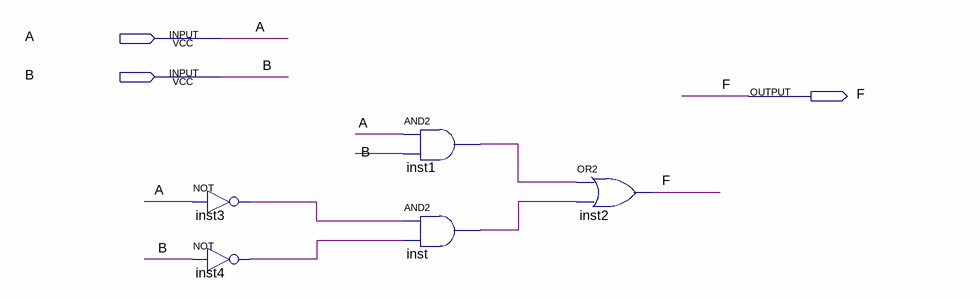
[diagram p0: schematic sheet]
// Quartus schematic circuit1.bdf as structural Verilog: 5 symbols, 3 pins
module circuit1 (
  input  A,
  input  B,
  output F
);

  wire inst1_out, inst3_out, inst4_out, inst_out;

  not inst3 (inst3_out, A);
  not inst4 (inst4_out, B);
  and inst1 (inst1_out, A, B);
  and inst (inst_out, inst3_out, inst4_out);
  or inst2 (F, inst1_out, inst_out);
endmodule
